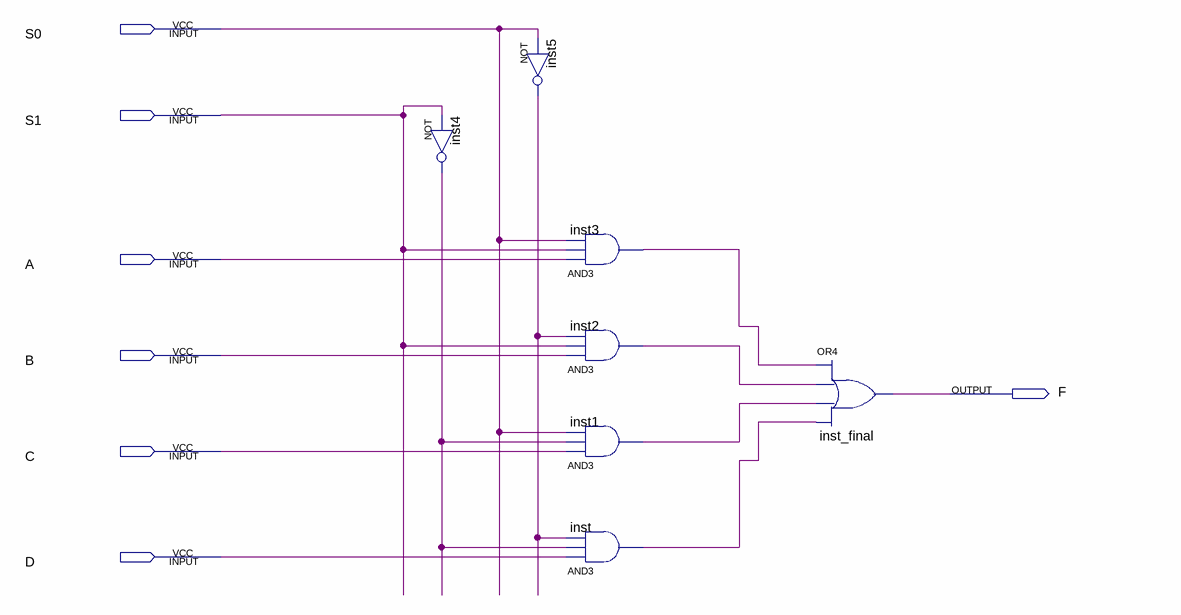
[diagram p0: schematic sheet]
// Quartus schematic mux4x1.bdf as structural Verilog: 7 symbols, 7 pins
module mux4x1 (
  input  S0,
  input  S1,
  input  A,
  input  B,
  input  C,
  input  D,
  output F
);

  wire inst1_out, inst2_out, inst3_out, inst4_out, inst5_out, inst_out;

  not inst4 (inst4_out, S1);
  not inst5 (inst5_out, S0);
  and inst3 (inst3_out, A, S1, S0);
  and inst2 (inst2_out, B, S1, inst5_out);
  and inst1 (inst1_out, C, inst4_out, S0);
  and inst (inst_out, D, inst4_out, inst5_out);
  or inst_final (F, inst3_out, inst2_out, inst1_out, inst_out);
endmodule
